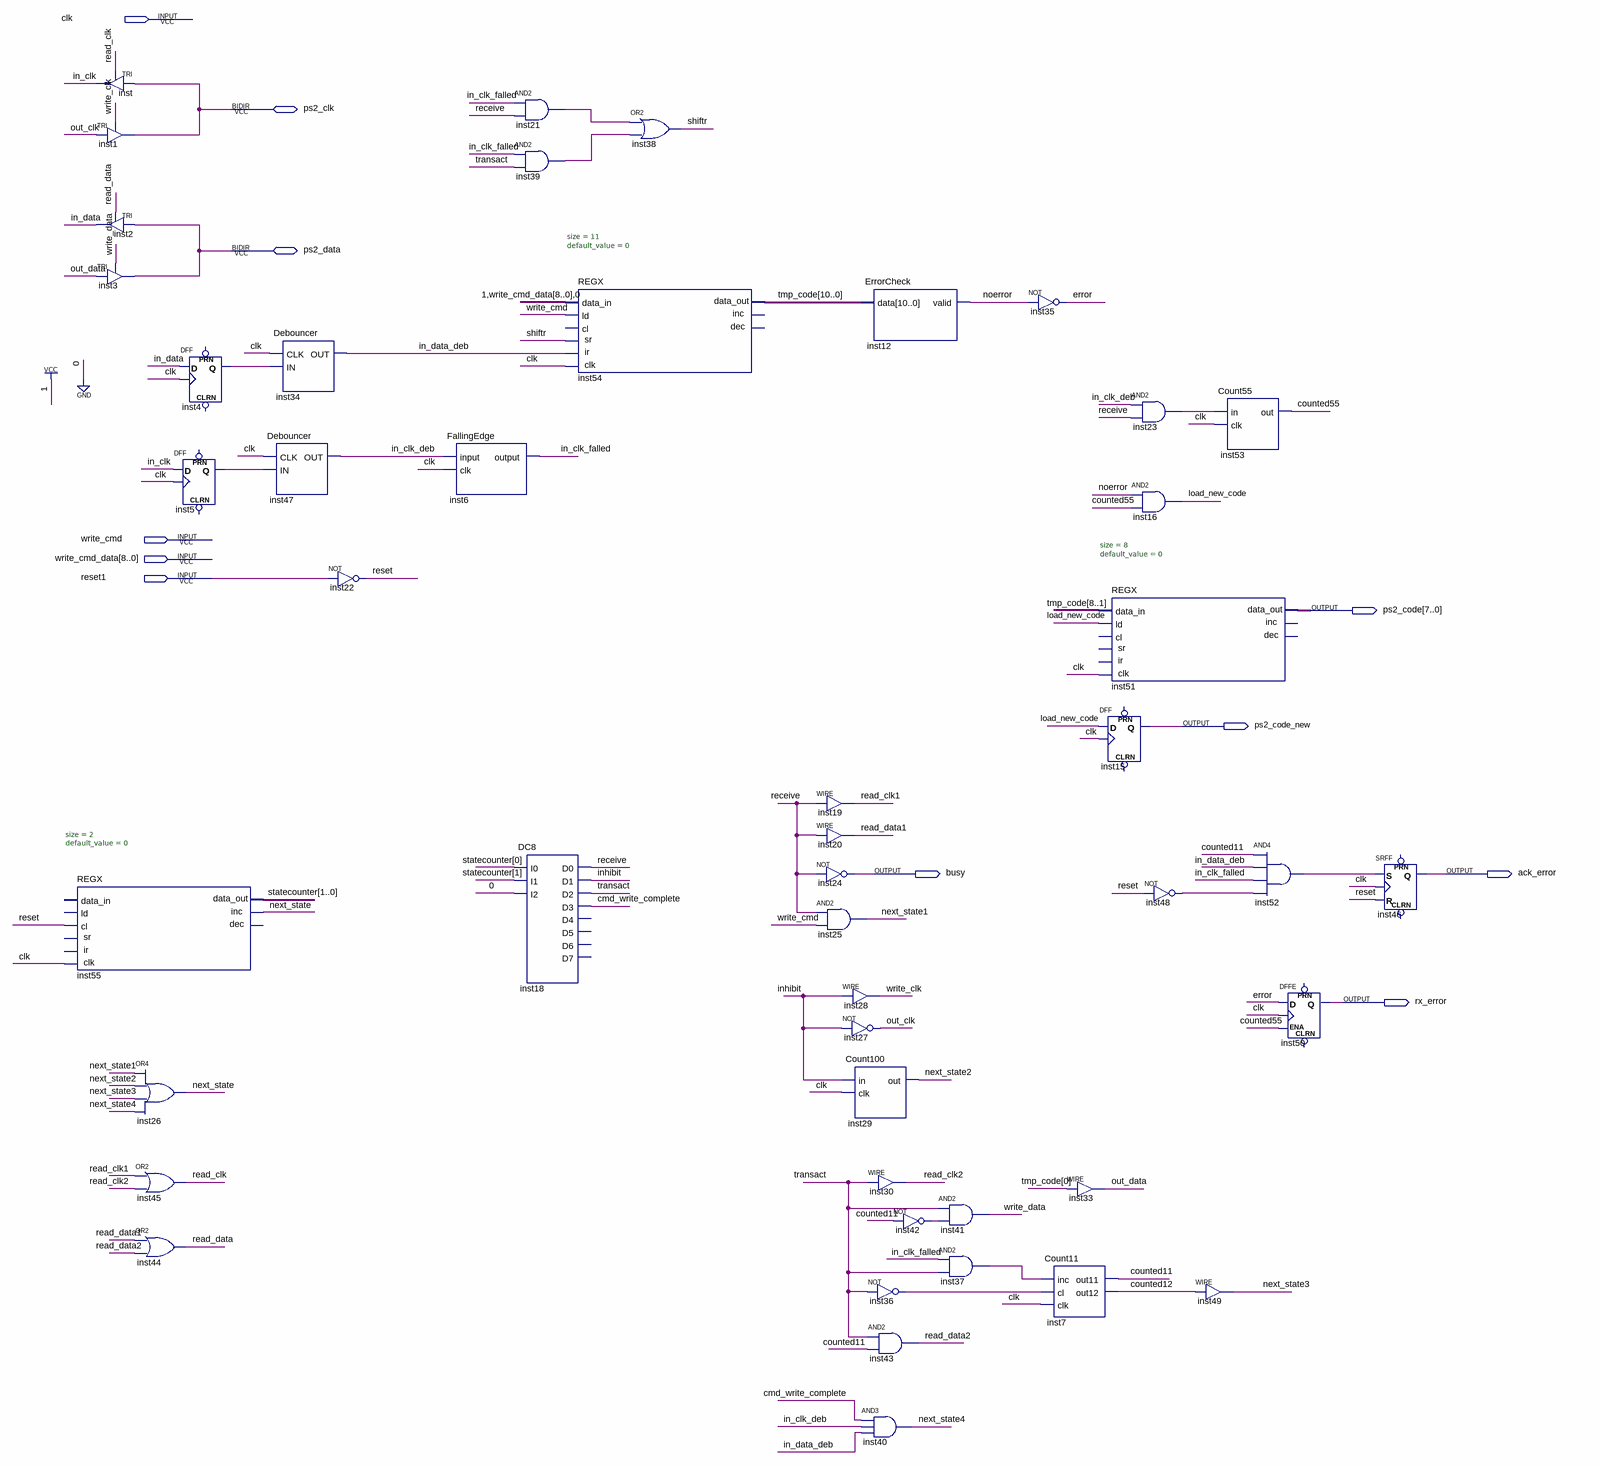
[diagram p0: schematic sheet]
// Quartus schematic PS2Communication.bdf as structural Verilog: 47 symbols, 11 pins
module PS2Communication (
  input  clk,
  input  write_cmd,
  input  [8:0] write_cmd_data,
  input  reset1,
  inout  ps2_clk,
  inout  ps2_data,
  output [7:0] ps2_code,
  output ps2_code_new,
  output busy,
  output ack_error,
  output rx_error
);

  wire cmd_write_complete, counted11, counted12, counted55, error, in_clk, in_clk_deb, in_clk_falled,
       in_data, in_data_deb, inhibit, inst4_q, inst5_q, inst21_out, inst23_out, inst36_out, inst37_out,
       inst39_out, inst42_out, inst48_out, inst52_out, load_new_code, next_state, next_state1, next_state2,
       next_state3, next_state4, noerror, out_clk, out_data, read_clk, read_clk1, read_clk2, read_data,
       read_data1, read_data2, receive, reset, shiftr, transact, write_clk, write_data;
  wire [1:0] statecounter;
  wire [10:0] tmp_code;

  TRI inst (.IN(ps2_clk), .OE(read_clk), .OUT(in_clk));
  TRI inst1 (.IN(out_clk), .OE(write_clk), .OUT(ps2_clk));
  TRI inst2 (.IN(ps2_data), .OE(read_data), .OUT(in_data));
  TRI inst3 (.IN(out_data), .OE(write_data), .OUT(ps2_data));
  REGX #(.size(2), .default_value(0)) inst55 (
    .clk(clk), .cl(reset), .inc(next_state), .data_out(statecounter));  // open: ld, dec, sr, ir, data_in
  or inst26 (next_state, next_state1, next_state2, next_state3, next_state4);
  or inst45 (read_clk, read_clk1, read_clk2);
  or inst44 (read_data, read_data1, read_data2);
  DFF inst4 (.CLK(clk), .D(in_data), .Q(inst4_q));  // open: CLRN, PRN
  DFF inst5 (.CLK(clk), .D(in_clk), .Q(inst5_q));  // open: CLRN, PRN
  Debouncer inst47 (.CLK(clk), .IN(inst5_q), .OUT(in_clk_deb));
  Debouncer inst34 (.CLK(clk), .IN(inst4_q), .OUT(in_data_deb));
  not inst22 (reset, reset1);
  FallingEdge inst6 (.\input (in_clk_deb), .clk(clk), .\output (in_clk_falled));
  and inst21 (inst21_out, in_clk_falled, receive);
  and inst39 (inst39_out, in_clk_falled, transact);
  DC8 inst18 (
    .I0(statecounter[0]), .I1(statecounter[1]), .I2(1'b0), .D0(receive), .D1(inhibit), .D2(transact),
    .D3(cmd_write_complete));  // open: D4, D5, D6, D7
  REGX #(.size(11), .default_value(0)) inst54 (
    .clk(clk), .ld(write_cmd), .sr(shiftr), .ir(in_data_deb), .data_in({1'b1, write_cmd_data, 1'b0}),
    .data_out(tmp_code));  // open: cl, inc, dec
  or inst38 (shiftr, inst21_out, inst39_out);
  assign read_clk1 = receive;  // WIRE inst19
  assign read_data1 = receive;  // WIRE inst20
  not inst24 (busy, receive);
  and inst25 (next_state1, receive, write_cmd);
  ErrorCheck inst12 (.data(tmp_code), .valid(noerror));
  assign write_clk = inhibit;  // WIRE inst28
  not inst27 (out_clk, inhibit);
  Count100 inst29 (.in(inhibit), .clk(clk), .out(next_state2));
  assign read_clk2 = transact;  // WIRE inst30
  not inst36 (inst36_out, transact);
  and inst43 (read_data2, transact, counted11);
  and inst40 (next_state4, cmd_write_complete, in_clk_deb, in_data_deb);
  not inst42 (inst42_out, counted11);
  and inst41 (write_data, transact, inst42_out);
  and inst37 (inst37_out, in_clk_falled, transact);
  not inst35 (error, noerror);
  assign out_data = tmp_code[0];  // WIRE inst33
  Count11 inst7 (.inc(inst37_out), .cl(inst36_out), .clk(clk), .out11(counted11), .out12(counted12));
  and inst23 (inst23_out, in_clk_deb, receive);
  and inst16 (load_new_code, noerror, counted55);
  REGX #(.size(8), .default_value(0)) inst51 (
    .clk(clk), .ld(load_new_code), .data_in(tmp_code[8:1]), .data_out(ps2_code));  // open: cl, inc, dec, sr, ir
  DFF inst15 (.CLK(clk), .D(load_new_code), .Q(ps2_code_new));  // open: CLRN, PRN
  not inst48 (inst48_out, reset);
  Count55 inst53 (.in(inst23_out), .clk(clk), .out(counted55));
  assign next_state3 = counted12;  // WIRE inst49
  and inst52 (inst52_out, counted11, in_data_deb, in_clk_falled, inst48_out);
  DFFE inst50 (.D(error), .CLK(clk), .ENA(counted55), .Q(rx_error));  // open: PRN, CLRN
  SRFF inst46 (.S(inst52_out), .R(reset), .CLK(clk), .Q(ack_error));  // open: PRN, CLRN
endmodule
